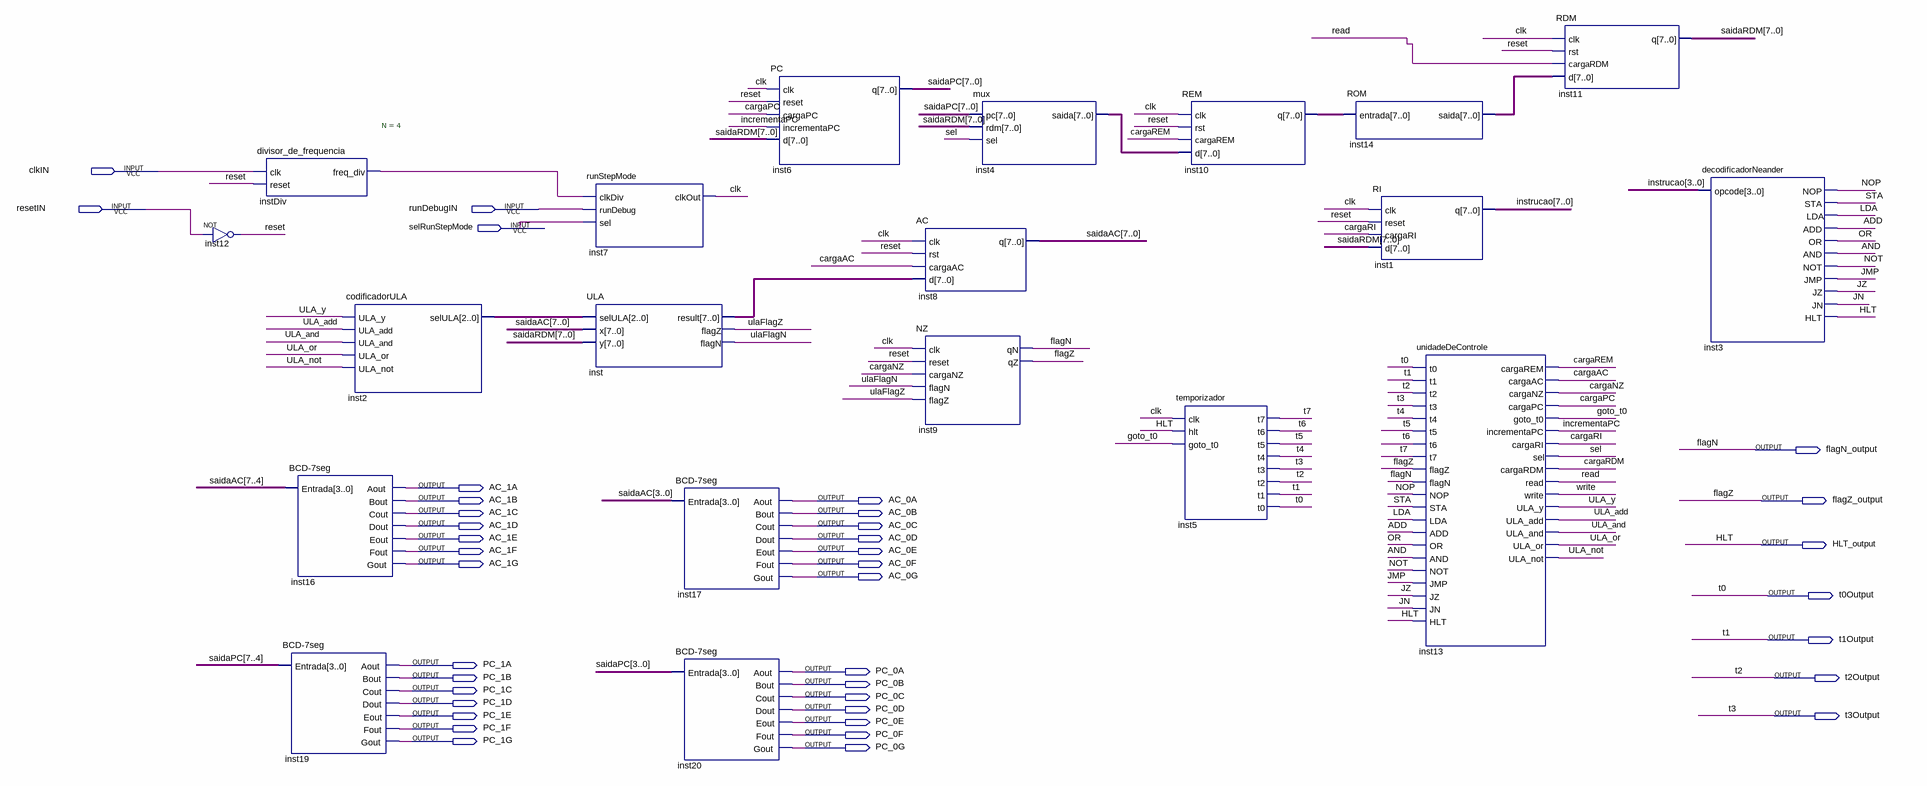
[diagram p0: schematic sheet]
// Quartus schematic neander.bdf as structural Verilog: 20 symbols, 39 pins
module neander (
  input  clkIN,
  input  resetIN,
  input  runDebugIN,
  input  selRunStepMode,
  output flagN_output,
  output AC_1A,
  output AC_1B,
  output AC_0A,
  output flagZ_output,
  output AC_1C,
  output AC_0B,
  output AC_1D,
  output AC_0C,
  output AC_1E,
  output AC_0D,
  output HLT_output,
  output AC_1F,
  output AC_0E,
  output AC_1G,
  output AC_0F,
  output AC_0G,
  output t0Output,
  output t1Output,
  output PC_1A,
  output PC_0A,
  output PC_1B,
  output t2Output,
  output PC_0B,
  output PC_1C,
  output PC_0C,
  output PC_1D,
  output PC_0D,
  output PC_1E,
  output t3Output,
  output PC_0E,
  output PC_1F,
  output PC_0F,
  output PC_1G,
  output PC_0G
);

  wire ADD, AND, cargaAC, cargaNZ, cargaPC, cargaRDM, cargaREM, cargaRI, clk, goto_t0, incrementaPC,
       instDiv_freq_div, JMP, JN, JZ, LDA, NOP, NOT, OR, read, reset, sel, STA, t4, t5, t6, t7, ULA_add,
       ULA_and, ULA_not, ULA_or, ULA_y, ulaFlagN, ulaFlagZ, write;
  wire [2:0] inst2_selula;
  wire [7:0] inst4_saida, inst10_q, inst14_saida, inst_result, instrucao, saidaAC, saidaPC, saidaRDM;

  not inst12 (reset, resetIN);
  divisor_de_frequencia #(.N(4)) instDiv (.clk(clkIN), .reset(reset), .freq_div(instDiv_freq_div));
  \BCD-7seg  inst16 (
    .Entrada(saidaAC[7:4]), .Aout(AC_1A), .Bout(AC_1B), .Cout(AC_1C), .Dout(AC_1D), .Eout(AC_1E),
    .Fout(AC_1F), .Gout(AC_1G));
  \BCD-7seg  inst19 (
    .Entrada(saidaPC[7:4]), .Aout(PC_1A), .Bout(PC_1B), .Cout(PC_1C), .Dout(PC_1D), .Eout(PC_1E),
    .Fout(PC_1F), .Gout(PC_1G));
  codificadorULA inst2 (
    .ULA_y(ULA_y), .ULA_add(ULA_add), .ULA_and(ULA_and), .ULA_or(ULA_or), .ULA_not(ULA_not),
    .selULA(inst2_selula));
  runStepMode inst7 (.clkDiv(instDiv_freq_div), .runDebug(runDebugIN), .sel(selRunStepMode), .clkOut(clk));
  ULA inst (.selULA(inst2_selula), .x(saidaAC), .y(saidaRDM), .result(inst_result), .flagZ(ulaFlagZ), .flagN(ulaFlagN));
  \BCD-7seg  inst17 (
    .Entrada(saidaAC[3:0]), .Aout(AC_0A), .Bout(AC_0B), .Cout(AC_0C), .Dout(AC_0D), .Eout(AC_0E),
    .Fout(AC_0F), .Gout(AC_0G));
  \BCD-7seg  inst20 (
    .Entrada(saidaPC[3:0]), .Aout(PC_0A), .Bout(PC_0B), .Cout(PC_0C), .Dout(PC_0D), .Eout(PC_0E),
    .Fout(PC_0F), .Gout(PC_0G));
  PC inst6 (.clk(clk), .reset(reset), .cargaPC(cargaPC), .incrementaPC(incrementaPC), .d(saidaRDM), .q(saidaPC));
  AC inst8 (.clk(clk), .rst(reset), .cargaAC(cargaAC), .d(inst_result), .q(saidaAC));
  NZ inst9 (
    .clk(clk), .reset(reset), .cargaNZ(cargaNZ), .flagN(ulaFlagN), .flagZ(ulaFlagZ), .qN(flagN_output),
    .qZ(flagZ_output));
  mux inst4 (.pc(saidaPC), .rdm(saidaRDM), .sel(sel), .saida(inst4_saida));
  REM inst10 (.clk(clk), .rst(reset), .cargaREM(cargaREM), .d(inst4_saida), .q(inst10_q));
  temporizador inst5 (
    .clk(clk), .hlt(HLT_output), .goto_t0(goto_t0), .t7(t7), .t6(t6), .t5(t5), .t4(t4), .t3(t3Output),
    .t2(t2Output), .t1(t1Output), .t0(t0Output));
  ROM inst14 (.entrada(inst10_q), .saida(inst14_saida));
  RI inst1 (.clk(clk), .reset(reset), .cargaRI(cargaRI), .d(saidaRDM), .q(instrucao));
  unidadeDeControle inst13 (
    .t0(t0Output), .t1(t1Output), .t2(t2Output), .t3(t3Output), .t4(t4), .t5(t5), .t6(t6), .t7(t7),
    .flagZ(flagZ_output), .flagN(flagN_output), .NOP(NOP), .STA(STA), .LDA(LDA), .ADD(ADD), .OR(OR),
    .AND(AND), .NOT(NOT), .JMP(JMP), .JZ(JZ), .JN(JN), .HLT(HLT_output), .cargaREM(cargaREM),
    .cargaAC(cargaAC), .cargaNZ(cargaNZ), .cargaPC(cargaPC), .goto_t0(goto_t0), .incrementaPC(incrementaPC),
    .cargaRI(cargaRI), .sel(sel), .cargaRDM(cargaRDM), .read(read), .write(write), .ULA_y(ULA_y),
    .ULA_add(ULA_add), .ULA_and(ULA_and), .ULA_or(ULA_or), .ULA_not(ULA_not));
  RDM inst11 (.clk(clk), .rst(reset), .cargaRDM(read), .d(inst14_saida), .q(saidaRDM));
  decodificadorNeander inst3 (
    .opcode(instrucao[3:0]), .NOP(NOP), .STA(STA), .LDA(LDA), .ADD(ADD), .OR(OR), .AND(AND), .NOT(NOT),
    .JMP(JMP), .JZ(JZ), .JN(JN), .HLT(HLT_output));

  // Other names for the same wires on the sheet: flagN = flagN_output; flagZ = flagZ_output; HLT = HLT_output;
  //   t0 = t0Output; t1 = t1Output; t2 = t2Output; t3 = t3Output
endmodule
